# EAGLE design USB proSupply (EAGLE 9.0.0)
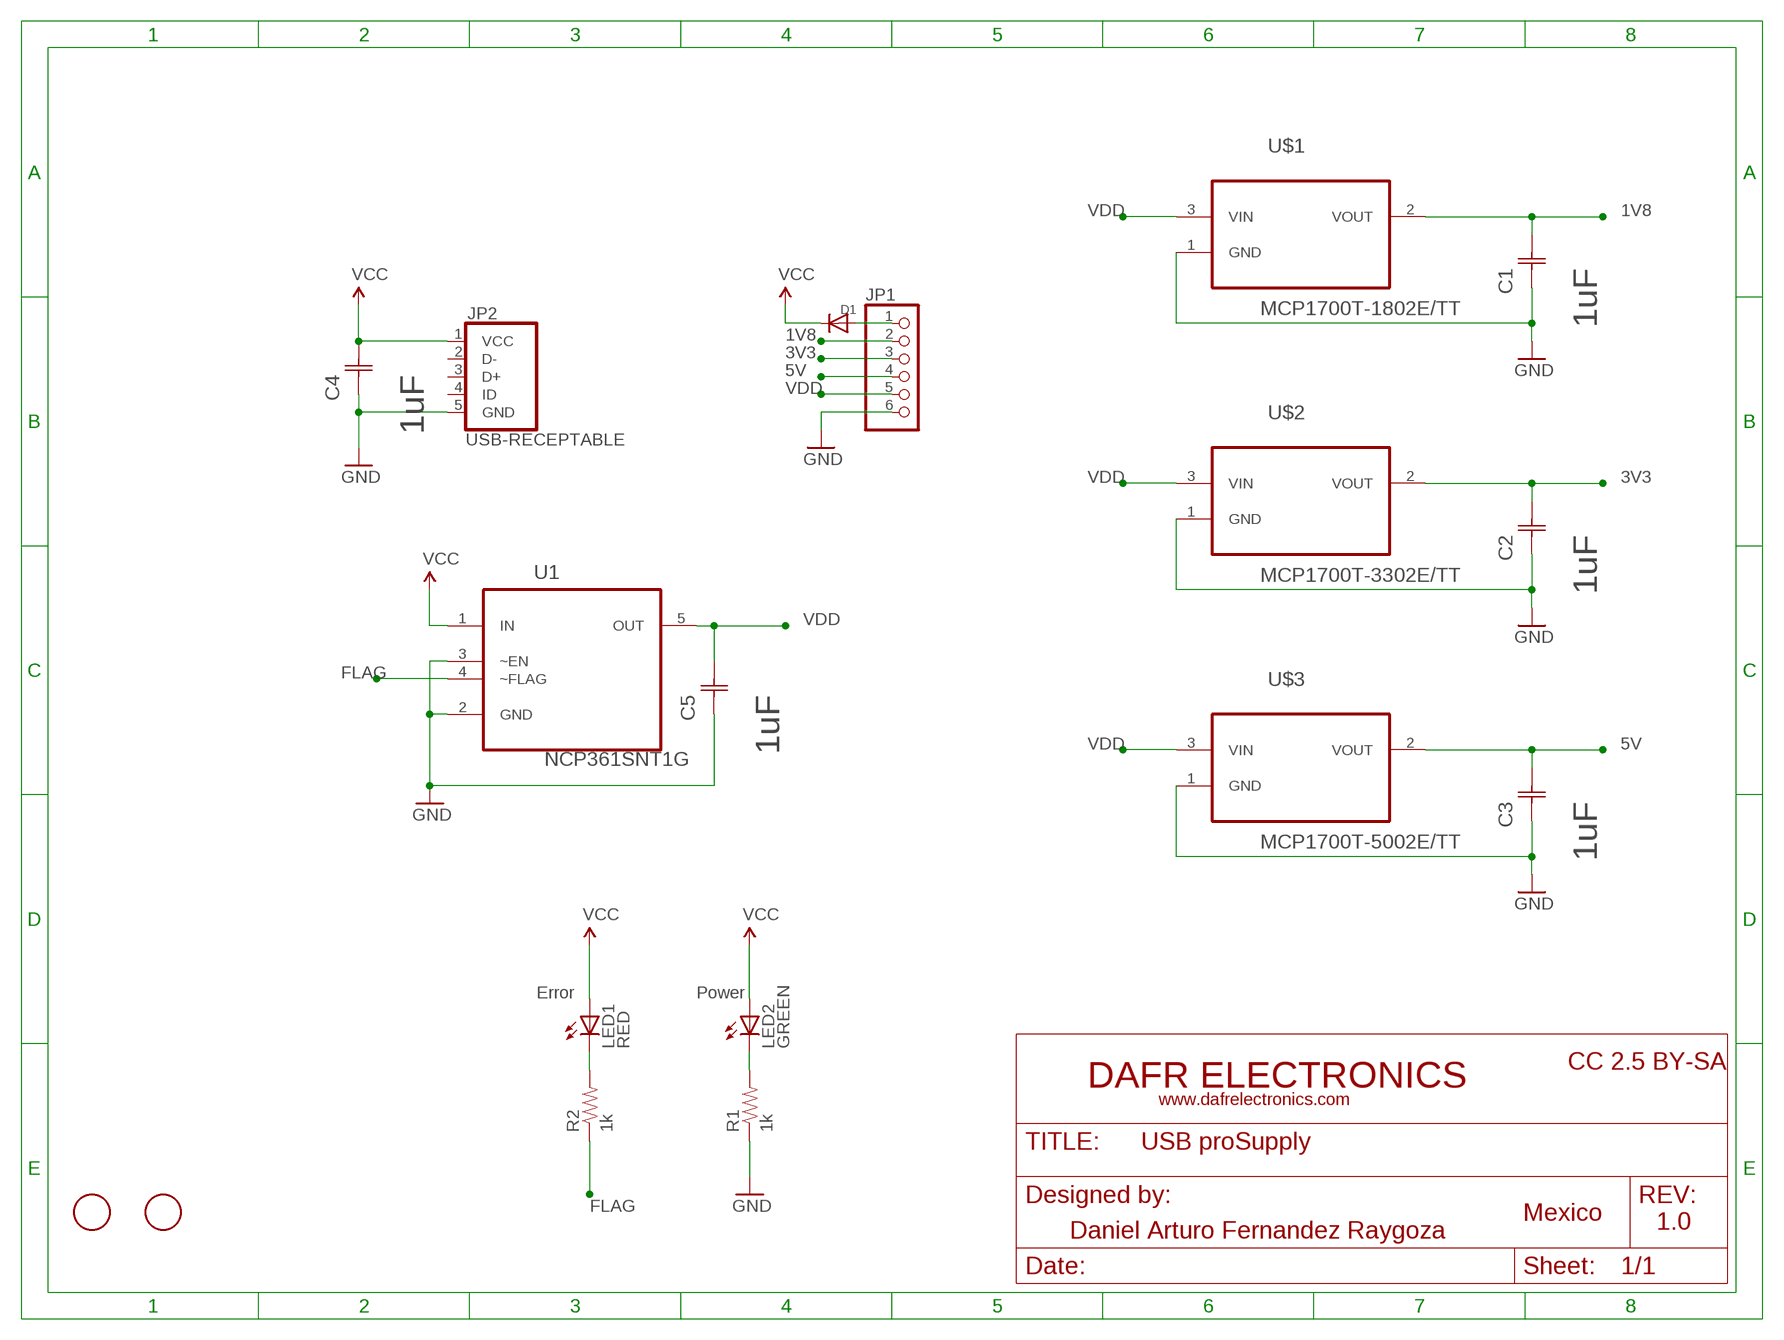
[diagram p0: schematic, sheet 1]

## Parts
C1  1uF  06033D105KAT2A  [CAPC1608X94N]
C2  1uF  06033D105KAT2A  [CAPC1608X94N]
C3  1uF  06033D105KAT2A  [CAPC1608X94N]
C4  1uF  06033D105KAT2A  [CAPC1608X94N]
C5  1uF  06033D105KAT2A  [CAPC1608X94N]
D1  DIODESOD-123  [SOD-123]
JP1  PINHD-1X6  [1X06]
JP2  USB-RECEPTABLE  [FCI-10103594-0001LF]
LED1  RED  LEDCHIPLED_1206  [CHIPLED_1206]
LED2  GREEN  LEDCHIPLED_1206  [CHIPLED_1206]
R1  1k  RESISTOR0805-RES  [0805]
R2  1k  RESISTOR0805-RES  [0805]
U1  NCP361SNT1G  [SOP95P275X110-5N]
U$1  MCP1700T-1802E/TT  [SOT95P237X112-3N]
U$2  MCP1700T-3302E/TT  [SOT95P237X112-3N]
U$3  MCP1700T-5002E/TT  [SOT95P237X112-3N]
U$5  FIDUCIAL  [FIDUCIAL_1MM]
U$6  FIDUCIAL  [FIDUCIAL_1MM]

## Nets
1V8: C1.2(C2) JP1.2 U$1.2(VOUT)
3V3: C2.2(C2) JP1.3 U$2.2(VOUT)
5V: C3.2(C2) JP1.4 U$3.2(VOUT)
FLAG: R2.1 U1.4(~FLAG)
GND: C1.1(C1) C2.1(C1) C3.1(C1) C4.1(C1) C5.1(C1) JP1.6 JP2.5(GND) R1.1 U1.2(GND) U1.3(~EN) U$1.1(GND) U$2.1(GND) U$3.1(GND)
N$1: D1.A JP1.1
N$2: LED1.C R2.2
N$3: LED2.C R1.2
VCC: C4.2(C2) D1.C JP2.1(VCC) LED1.A LED2.A U1.1(IN)
VDD: C5.2(C2) JP1.5 U1.5(OUT) U$1.3(VIN) U$2.3(VIN) U$3.3(VIN)
Unconnected: JP2.2(D-) JP2.3(D+) JP2.4(ID)

## Notes on the sheet
- Error | Power
- 1.0

## Library data of the parts
C1-C5 = AVX-06033D105KAT2A:06033D105KAT2A: Capacitor 0603; MPN: 06033D105KAT2A; OC_FARNELL: 1658868; OC_NEWARK: 96M1265; SUPPLIER: AVX; TOLERANCE: ±10%; VOLTAGERATING: 25V
D1 = adafruit:DIODE: Diode SMADIODE - SMA Surface Mount Package 20V 1A Schottky Diode Digikey: 641-1014-6-ND DO-1N4148 - Through Hole Small Current Diode SOD-123 20V 1 A (.5mV Vf) Schottky Diode - Digikey: MBRX120TPMSCT-ND SOD-323 10V 570mA (.38mV Vf, 3ns) Schottky Diode - Digikey: ZLLS410CT-ND SOD-523 30V 30mA Schottky Diode (RB751S-40TE61) - Digikey: RB751S-40TE61CT-ND SOT23-R/W - SOT23 Package (R = Solder Paste/Reflow Ovens, W = Hand-Soldering) BAT54Film 40V 300mA - Digikey: 497-7162-1-ND
JP1 = adafruit:PINHD-1X6: PIN HEADER
JP2 = daspilker:USB-RECEPTABLE: USB Receptable
LED1 LED2 = adafruit:LED: LED OSRAM: - CHIPLED LG R971, LG N971, LY N971, LG Q971, LY Q971, LO R971, LY R971 LH N974, LH R974 LS Q976, LO Q976, LY Q976 LO Q996 - Hyper CHIPLED LW Q18S LB Q993, LB Q99A, LB R99A - SideLED LS A670, LO A670, LY A670, LG A670, LP A670 LB A673, LV A673, LT A673, LW A673 LH A674 LY A675 LS A676, LA A676, LO A676, LY A676, LW A676 LS A679, LY A679, LG A679 - Hyper Micro SIDELED® LS Y876, LA Y876, LO Y876, LY Y876 LT Y87S - SmartLED LW L88C, LW L88S LB L89C, LB L89S, LG L890 LS L89K, LO L89K, LY L89K LS L896, LA L896, LO L896, LY L896 - TOPLED LS T670, LO T670, LY T670, LG T670, LP T670 LSG T670, LSP T670, LSY T670, LOP T670, LYG T670 LG T671, LOG T671, LSG T671 LB T673, LV T673, LT T673, LW T673 LH T674 LS T676, LA T676, LO T676, LY T676, LB T676, LH T676, LSB T676, LW T676 LB T67C, LV T67C, LT T67C, LS T67K, LO T67K, LY T67K, LW E67C LS E67B, LA E67B, LO E67B, LY E67B, LB E67C, LV E67C, LT E67C LW T67C LS T679, LY T679, LG T679 LS T770, LO T770, LY T770, LG T770, LP T770 LB T773, LV T773, LT T773, LW T773 LH T774 LS E675, LA E675, LY E675, LS T675 LS T776, LA T776, LO T776, LY T776, LB T776 LHGB T686 LT T68C, LB T68C - Hyper Mini TOPLED® LB M676 - Mini TOPLED Santana® LG M470 LS M47K, LO M47K, LY M47K Source: http://www.osram.convergy.de/
R1 R2 = SparkFun-Resistors:RESISTOR: Resistor Basic schematic elements and footprints for 0603, 1206, and PTH resistors.
U1 = NCP361SNT1G:NCP361SNT1G: USB Positive Overvoltage Protection Controller; MPN: NCP361SNT1G; OC_FARNELL: 1642242; OC_NEWARK: 01P0135; PACKAGE: TSOP-5; SUPPLIER: ON Semiconductor
U$1 = MCP1700T-1802E:MCP1700T-1802E/TT: Low Quiescent Current LDO; MPN: MCP1700T-1802E/TT; OC_FARNELL: 1296591; OC_NEWARK: 84R5175; PACKAGE: SOT23-3; SUPPLIER: Microchip
U$2 = MCP1700T-3302E:MCP1700T-3302E/TT: Low Quiescent Current LDO; MPN: MCP1700T-3302E/TT; OC_FARNELL: 1296592; OC_NEWARK: 88H9817; PACKAGE: SOT23-3; SUPPLIER: Microchip
U$3 = MCP1700T-5002E:MCP1700T-5002E/TT: Low Quiescent Current LDO; MPN: MCP1700T-5002E/TT; OC_FARNELL: 1296593; OC_NEWARK: 88H9819; PACKAGE: SOT23-3; SUPPLIER: Microchip
U$5 U$6 = adafruit:FIDUCIAL: For use by pick and place machines to calibrate the vision/machine, 1mm By microbuilder.eu

## Board
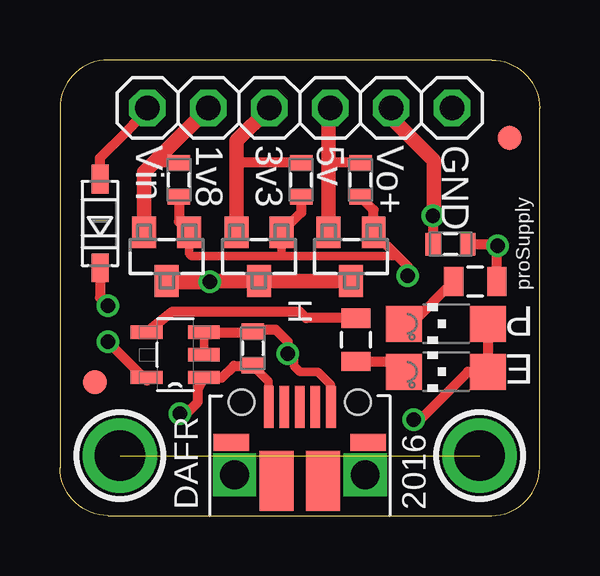
[diagram p1: board, top side]
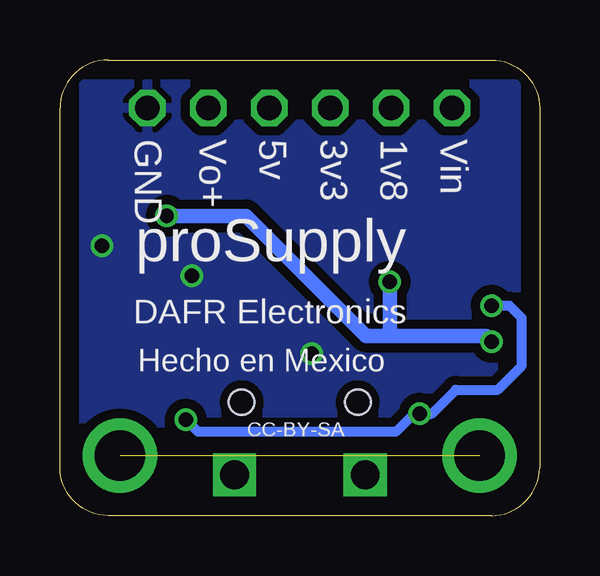
[diagram p2: board, bottom side, seen from below]

Size 20 x 19 mm. Coordinates in mm from the lower left corner, seen from the top.
Outline: 2,0 18,0 arc90 20,2 20,17 arc90 18,19 2,19 arc90 0,17 0,2 arc90 2,0
Copper layers (1*16): Top 0.0356mm / dielectric 1.5011mm / Bottom 0.0356mm
Design rules "LaenPCBOrder *": minimum track width 6mil, minimum drill 13mil, track to track 6mil, track to pad 6mil, pad to pad 6mil, via to via 6mil, smd to smd 6mil, copper to edge 15mil, drill to drill 6mil, minimum pad ring 7mil, minimum via ring 7mil, stop-mask expansion 3mil, vias tented up to drill 30mil, thermal gap 10mil

### Footprints (pad centres in the part's own frame; a part is rotated, then mirrored left to right if it is on the bottom)
CAPC1608X94N = smd 0.66 x 0.94: 1 -0.711,0; 2 0.711,0
SOD-123 = smd 1.2 x 0.7: A 1.85,0; C -1.85,0
1X06 = drill 1.016 octagon: 1 -6.35,0; 2 -3.81,0; 3 -1.27,0; 4 1.27,0; 5 3.81,0; 6 6.35,0
FCI-10103594-0001LF = smd 0.4 x 1.75: 1 -1.3,4.525; 2 -0.65,4.525; 3 0,4.525; 4 0.65,4.525; 5 1.3,4.525 | smd 1.475 x 0.7: P$1 2.85,3.05; P$6 -2.85,3.05 | smd 1.425 x 2.5: P$2 0.963,1.45; P$5 -0.963,1.45 | drill 1.2 pad 1.8 square: P$3 -2.725,1.7; P$4 2.725,1.7 | hole 1.05: -2.425,4.73; 2.425,4.73
CHIPLED_1206 = smd 1.5 x 1.5: A 0,-1.75; C 0,1.75
0805 = smd 0.8 x 1.2: 1 -0.9,0; 2 0.9,0
SOP95P275X110-5N = smd 1.321 x 0.559: 1 -1.194,0.94; 2 -1.194,0; 3 -1.194,-0.94; 4 1.194,-0.94; 5 1.194,0.94
SOT95P237X112-3N = smd 0.991 x 1.321: 1 -0.94,-1.016; 2 0.94,-1.016; 3 0,1.016
FIDUCIAL_1MM = smd 1 x 1: 1 0,0

### Placement (x,y rotation side)
C1  4.96,14 90 top
C2  10.06,14 90 top
C3  12.54,14 90 top
C4  8.04,6.97 270 top
C5  16.29,11.32 180 top
D1  1.67,12.18 90 top
JP1  10,17 0 top
JP2  10,0 0 top
LED1  16.1,6 90 top
LED2  16.1,8 90 top
R1  17.32,9.76 180 top
R2  12.34,7.33 270 top
U1  4.81,6.7 180 top
U$1  4.45,10.8 180 top
U$2  8.3,10.8 180 top
U$3  12.14,10.8 180 top
U$5  18.75,15.75 0 top
U$6  1.45,5.57 0 top

### Tracks (layer width: path | path; a pad name or v marks a point on that pad's centre or on a via)
1V8
  Top 0.406: 5.09,14.71 C1.2 4.22,14.71 4.22,15.03
  Top 0.61: U$1.2 3.51,14.32 4.22,15.03 JP1.2
3V3
  Top 0.406: C2.2 7.36,14.71 7.36,15
  Top 0.61: U$2.2 7.36,15 7.36,15.63 JP1.3
5V
  Top 0.406: C3.2 11.2,14.71 11.2,14.5
  Top 0.61: U$3.2 11.2,14.5 11.2,16.93 JP1.4
FLAG
  Top 0.406: R2.1 10.27,8.23 10,8.5 4.68,8.5 U1.4
GND  (via drill 0.6)
  Top 0.356: U1.2 U1.3 | v9.5,6.75 9.75,6.5 9.75,6.25 10,6 10.75,6 11.3,5.45 JP2.5 | U$1.1 5.39,10.92 5.49,10.82 9.3,10.82 | 9.3,10.82 14.07,10.82 14.12,10.77 | U$2.1 9.24,10.88 9.3,10.82
  Top 0.406: v9.5,6.75 9.5,7.25 9,7.75 8.11,7.75 C4.1 8,7.64 U1.3 | R1.1 18.21,11.21 v18.25,11.25 18.18,11.32 C5.1 | v14.5,10 14.5,10.4 14.12,10.77 U$3.1 13.08,12.74 C3.1 | C1.1 4.96,12.24 U$1.1 | C2.1 10.06,12.63 U$2.1
  pour Bottom (isolate 0.381): 1,18 1,3 19,3 19,18
N$1
  Top 0.406: D1.A 1.67,14.92 2.75,16 JP1.1
N$2
  Top 0.406: R2.2 14.17,6.43 LED1.C
N$3
  Top 0.406: LED2.C 14.65,8 R1.2
N$4  (via drill 2.1 pad 2.54)  (1 unrouted)
  other vias: 2.5,2.5 17.5,2.5
VCC  (via drill 0.6)
  Top 0.356: JP2.1 8.7,5.6 C4.2
  Top 0.406: v5,4.25 5.25,4.25 5.75,4.75 5.75,5.3 U1.1 6.76,5.76 7.25,6.25 C4.2 | D1.C 1.67,9.08 v2,8.75 | v14.75,4 15,4 17,6 LED1.A LED2.A
  Bottom 0.406: v2,8.75 1.25,8.75 0.75,8.25 0.75,6.25 1.75,5.25 3.5,5.25 4.5,4.25 v5,4.25 5.25,4.25 6,3.5 14.25,3.5 v14.75,4
VDD  (via drill 0.6)
  Top 0.406: U1.5 3.62,5.63 v2,7.25 | C5.2 15.58,11.67 v15.55,12.5
  Top 0.61: U$3.3 U$2.3 6.25,9.78 v6.25,9.75 4.45,9.75 U$1.3 | JP1.5 13.81,16.59 15.6,14.8 15.6,12.55 v15.55,12.5
  Bottom 0.61: v15.55,12.5 12.25,12.5 7.25,7.5 6.25,7.5 | 6.25,7.5 2.25,7.5 v2,7.25 | v6.25,9.75 6.25,7.5

### Text on the board
tPlace: Vin | 1v8 | 3v3 | 5v | Vo+ | GND | proSupply | P | H | E | DAFR | 2016
bPlace: Vin | 1v8 | 3v3 | 5v | Vo+ | GND | proSupply | DAFR Electronics | Hecho en Mexico | CC-BY-SA